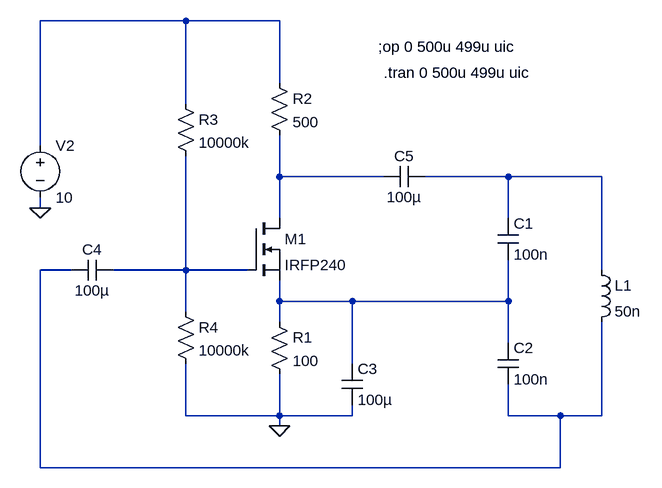
[diagram p0: schematic Colpits Oscillator.asc]
Colpits Oscillator.asc, the LTspice schematic file:
Version 4
SHEET 1 880 680
WIRE -9344 -9456 -9568 -9456
WIRE -9200 -9456 -9344 -9456
WIRE -9200 -9360 -9200 -9456
WIRE -9344 -9328 -9344 -9456
WIRE -9568 -9264 -9568 -9456
WIRE -9200 -9216 -9200 -9280
WIRE -9040 -9216 -9200 -9216
WIRE -8848 -9216 -8976 -9216
WIRE -8704 -9216 -8848 -9216
WIRE -9568 -9168 -9568 -9184
WIRE -9200 -9152 -9200 -9216
WIRE -8848 -9152 -8848 -9216
WIRE -9520 -9072 -9568 -9072
WIRE -9344 -9072 -9344 -9248
WIRE -9344 -9072 -9456 -9072
WIRE -9248 -9072 -9344 -9072
WIRE -8704 -9072 -8704 -9216
WIRE -9200 -9024 -9200 -9056
WIRE -9088 -9024 -9200 -9024
WIRE -8848 -9024 -8848 -9088
WIRE -8848 -9024 -9088 -9024
WIRE -9344 -9008 -9344 -9072
WIRE -9200 -8992 -9200 -9024
WIRE -8848 -8960 -8848 -9024
WIRE -9088 -8928 -9088 -9024
WIRE -9344 -8848 -9344 -8928
WIRE -9200 -8848 -9200 -8912
WIRE -9200 -8848 -9344 -8848
WIRE -9088 -8848 -9088 -8864
WIRE -9088 -8848 -9200 -8848
WIRE -8848 -8848 -8848 -8896
WIRE -8768 -8848 -8848 -8848
WIRE -8704 -8848 -8704 -8992
WIRE -8704 -8848 -8768 -8848
WIRE -9200 -8832 -9200 -8848
WIRE -9568 -8768 -9568 -9072
WIRE -8768 -8768 -8768 -8848
WIRE -8768 -8768 -9568 -8768
FLAG -9200 -8832 0
FLAG -9568 -9168 0
SYMBOL res -9360 -9024 R0
SYMATTR InstName R4
SYMATTR Value 10000k
SYMBOL cap -8864 -9152 R0
SYMATTR InstName C1
SYMATTR Value 100n
SYMBOL cap -8976 -9232 R90
WINDOW 0 0 32 VBottom 2
WINDOW 3 32 32 VTop 2
SYMATTR InstName C5
SYMATTR Value 100µ
SYMBOL res -9216 -9376 R0
SYMATTR InstName R2
SYMATTR Value 500
SYMBOL voltage -9568 -9280 R0
SYMATTR InstName V2
SYMATTR Value 10
SYMBOL res -9360 -9344 R0
SYMATTR InstName R3
SYMATTR Value 10000k
SYMBOL ind -8720 -9088 R0
SYMATTR InstName L1
SYMATTR Value 50n
SYMBOL nmos -9248 -9152 R0
SYMATTR InstName M1
SYMATTR Value IRFP240
SYMBOL cap -9456 -9088 R90
WINDOW 0 0 32 VBottom 2
WINDOW 3 32 32 VTop 2
SYMATTR InstName C4
SYMATTR Value 100µ
SYMBOL res -9216 -9008 R0
SYMATTR InstName R1
SYMATTR Value 100
SYMBOL cap -9104 -8928 R0
SYMATTR InstName C3
SYMATTR Value 100µ
SYMBOL cap -8864 -8960 R0
SYMATTR InstName C2
SYMATTR Value 100n
TEXT -9048 -9416 Left 2 !;op 0 500u 499u uic
TEXT -9040 -9376 Left 2 !.tran 0 500u 499u uic

The netlist it stands for:
* Colpits Oscillator.asc
R4 N005 0 10000k
C1 N003 N006 100n
C5 N003 N002 100µ
R2 N001 N002 500
V2 N001 0 10
R3 N001 N005 10000k
L1 N003 N004 50n
M1 N002 N005 N006 N006 IRFP240
C4 N005 N004 100µ
R1 N006 0 100
C3 N006 0 100µ
C2 N006 N004 100n
.model NMOS NMOS
.model PMOS PMOS
.lib standard.mos
;op 0 500u 499u uic
.tran 0 500u 499u uic
.backanno
.end